# EAGLE design Dual_OTA_VCA (EAGLE 7.2.0)
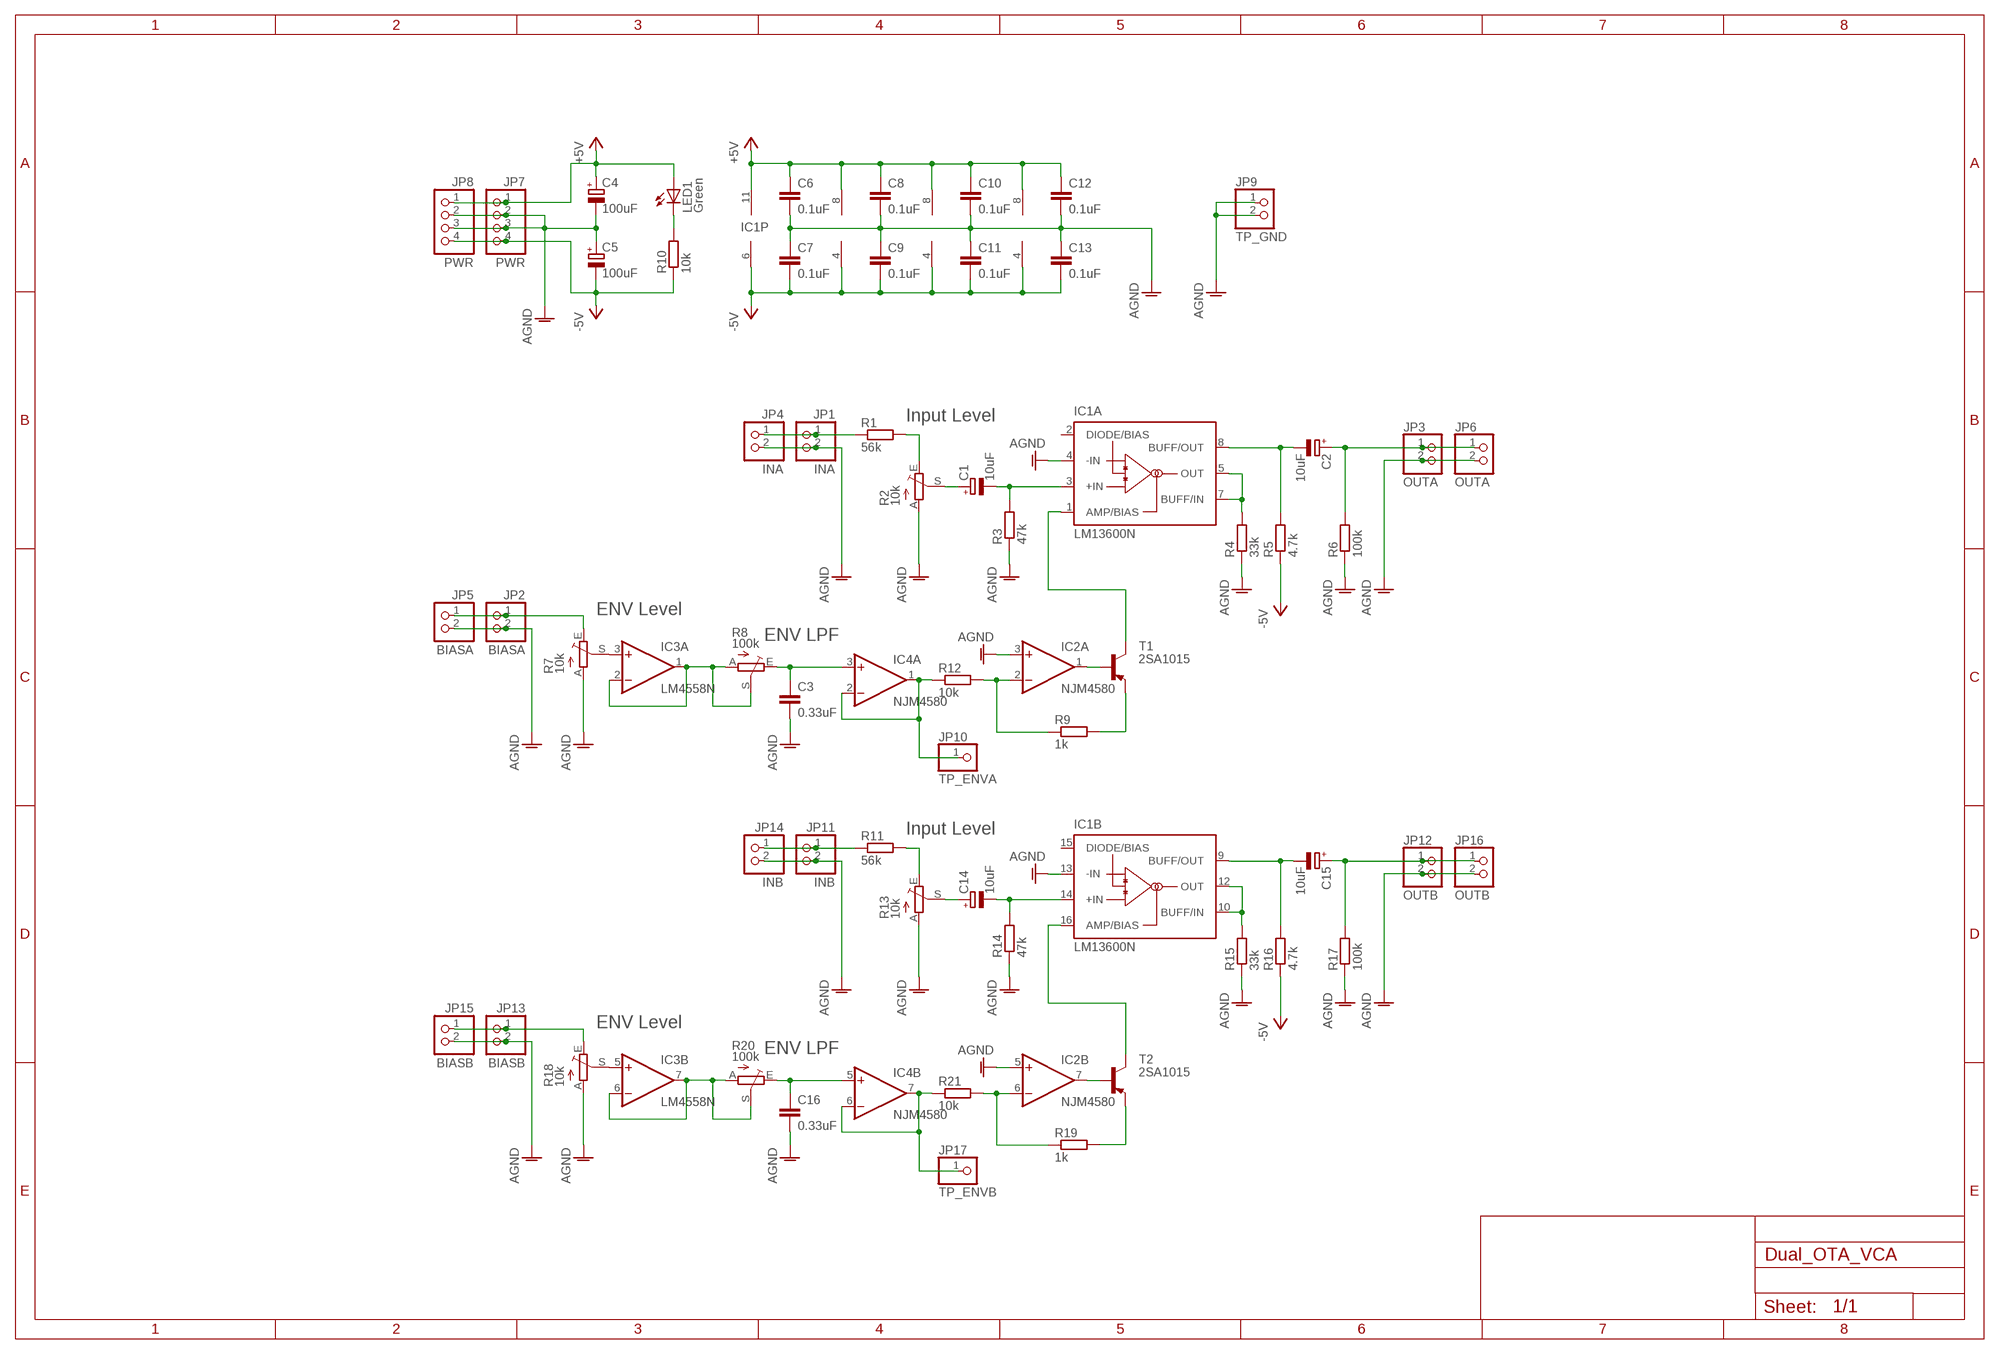
[diagram p0: schematic, sheet 1]

## Parts
C1  10uF  CPOL-EUE2.5-7  [E2,5-7]
C2  10uF  CPOL-EUE2.5-7  [E2,5-7]
C3  0.33uF  C-EU050-030X075  [C050-030X075]
C4  100uF  CPOL-EUE2.5-7  [E2,5-7]
C5  100uF  CPOL-EUE2.5-7  [E2,5-7]
C6  0.1uF  C-EU050-024X044  [C050-024X044]
C7  0.1uF  C-EU050-024X044  [C050-024X044]
C8  0.1uF  C-EU025-024X044  [C025-024X044]
C9  0.1uF  C-EU025-024X044  [C025-024X044]
C10  0.1uF  C-EU025-024X044  [C025-024X044]
C11  0.1uF  C-EU025-024X044  [C025-024X044]
C12  0.1uF  C-EU025-024X044  [C025-024X044]
C13  0.1uF  C-EU025-024X044  [C025-024X044]
C14  10uF  CPOL-EUE2.5-7  [E2,5-7]
C15  10uF  CPOL-EUE2.5-7  [E2,5-7]
C16  0.33uF  C-EU050-030X075  [C050-030X075]
IC1  LM13600N  [DIL16]
IC2  NJM4580  LM4558N  [DIL08]
IC3  LM4558N  [DIL08]
IC4  NJM4580  LM4558N  [DIL08]
JP1  INA  PINHD-1X2  [1X02]
JP2  BIASA  PINHD-1X2  [1X02]
JP3  OUTA  PINHD-1X2  [1X02]
JP4  INA  PINHD-1X2  [1X02]
JP5  BIASA  PINHD-1X2  [1X02]
JP6  OUTA  PINHD-1X2  [1X02]
JP7  PWR  PINHD-1X4  [1X04]
JP8  PWR  PINHD-1X4  [1X04]
JP9  TP_GND  PINHD-1X2  [1X02]
JP10  TP_ENVA  PINHD-1X1  [1X01]
JP11  INB  PINHD-1X2  [1X02]
JP12  OUTB  PINHD-1X2  [1X02]
JP13  BIASB  PINHD-1X2  [1X02]
JP14  INB  PINHD-1X2  [1X02]
JP15  BIASB  PINHD-1X2  [1X02]
JP16  OUTB  PINHD-1X2  [1X02]
JP17  TP_ENVB  PINHD-1X1  [1X01]
LED1  Green  LED3MM  [LED3MM]
R1  56k  R-EU_0207/7  [0207/7]
R2  10k  TRIM_EU-B25P  [B25P]
R3  47k  R-EU_0207/7  [0207/7]
R4  33k  R-EU_0207/7  [0207/7]
R5  4.7k  R-EU_0207/7  [0207/7]
R6  100k  R-EU_0207/7  [0207/7]
R7  10k  TRIM_EU-B25P  [B25P]
R8  100k  TRIM_EU-B25P  [B25P]
R9  1k  R-EU_0207/7  [0207/7]
R10  10k  R-EU_0207/7  [0207/7]
R11  56k  R-EU_0207/7  [0207/7]
R12  10k  R-EU_0207/7  [0207/7]
R13  10k  TRIM_EU-B25P  [B25P]
R14  47k  R-EU_0207/7  [0207/7]
R15  33k  R-EU_0207/7  [0207/7]
R16  4.7k  R-EU_0207/7  [0207/7]
R17  100k  R-EU_0207/7  [0207/7]
R18  10k  TRIM_EU-B25P  [B25P]
R19  1k  R-EU_0207/7  [0207/7]
R20  100k  TRIM_EU-B25P  [B25P]
R21  10k  R-EU_0207/7  [0207/7]
T1  2SA1015  -PNP-TO92-ECB  [TO92-ECB]
T2  2SA1015  -PNP-TO92-ECB  [TO92-ECB]

## Nets
+5V: C4.+ C6.1 C8.1 C10.1 C12.1 IC1.11(P:V+) IC2.8(P:V+) IC3.8(P:V+) IC4.8(P:V+) JP7.1 JP8.1 LED1.A
-5V: C5.- C7.2 C9.2 C11.2 C13.2 IC1.6(P:V-) IC2.4(P:V-) IC3.4(P:V-) IC4.4(P:V-) JP7.4 JP8.4 R5.1 R10.1 R16.1
AGND: C3.2 C4.- C5.+ C6.2 C7.1 C8.2 C9.1 C10.2 C11.1 C12.2 C13.1 C16.2 IC1.4(A:-IN) IC1.13(B:-IN) IC2.3(A:+IN) IC2.5(B:+IN) JP1.2 JP2.2 JP3.2 JP4.2 JP5.2 JP6.2 JP7.2 JP7.3 JP8.2 JP8.3 JP9.1 JP9.2 JP11.2 JP12.2 JP13.2 JP14.2 JP15.2 JP16.2 R2.A R3.1 R4.1 R6.1 R7.A R13.A R14.1 R15.1 R17.1 R18.A
N$1: JP1.1 JP4.1 R1.1
N$2: R1.2 R2.E
N$3: C1.+ R2.S
N$4: C1.- IC1.3(A:+IN) R3.2
N$5: IC1.5(A:OUT) IC1.7(A:BUFF/IN) R4.2
N$6: C2.- IC1.8(A:BUFF/OUT) R5.2
N$7: IC4.1(A:OUT) IC4.2(A:-IN) JP10.1 R12.1
N$8: C2.+ JP3.1 JP6.1 R6.2
N$9: IC2.2(A:-IN) R9.1 R12.2
N$10: JP2.1 JP5.1 R7.E
N$11: R9.2 T1.E
N$12: IC2.1(A:OUT) T1.B
N$13: IC3.5(B:+IN) R18.S
N$14: IC1.1(A:AMP/BIAS) T1.C
N$15: LED1.K(C) R10.2
N$16: JP11.1 JP14.1 R11.1
N$17: IC3.3(A:+IN) R7.S
N$18: IC3.1(A:OUT) IC3.2(A:-IN) R8.A R8.S
N$19: C3.1 IC4.3(A:+IN) R8.E
N$20: R11.2 R13.E
N$21: C14.+ R13.S
N$22: C14.- IC1.14(B:+IN) R14.2
N$23: IC1.10(B:BUFF/IN) IC1.12(B:OUT) R15.2
N$24: C15.- IC1.9(B:BUFF/OUT) R16.2
N$25: C15.+ JP12.1 JP16.1 R17.2
N$26: JP13.1 JP15.1 R18.E
N$27: IC2.6(B:-IN) R19.1 R21.2
N$28: R19.2 T2.E
N$29: IC2.7(B:OUT) T2.B
N$30: IC1.16(B:AMP/BIAS) T2.C
N$32: IC3.6(B:-IN) IC3.7(B:OUT) R20.A R20.S
N$33: C16.1 IC4.5(B:+IN) R20.E
N$34: IC4.6(B:-IN) IC4.7(B:OUT) JP17.1 R21.1
Unconnected: IC1.2(A:DIODE/BIAS) IC1.15(B:DIODE/BIAS)

## Notes on the sheet
- Input Level
- ENV Level
- ENV LPF
- Input Level
- ENV Level
- ENV LPF

## Library data of the parts
C1 C2 C4 C5 C14 C15 = rcl:CPOL-EU: POLARIZED CAPACITOR, European symbol
C3 C6-C13 C16 = rcl:C-EU: CAPACITOR, European symbol
IC1 = national-semiconductor:LM13600: Dual Operational Transconductance Amplifiers with Linearizing Diodes and Buffers Source: lm13600.PDF
IC2-IC4 = linear:*4558: OP AMP
JP1-JP6 JP9 JP11-JP16 = pinhead:PINHD-1X2: PIN HEADER
JP7 JP8 = pinhead:PINHD-1X4: PIN HEADER
JP10 JP17 = pinhead:PINHD-1X1: PIN HEADER
LED1 = led:LED: LED OSRAM: - CHIPLED LG R971, LG N971, LY N971, LG Q971, LY Q971, LO R971, LY R971 LH N974, LH R974 LS Q976, LO Q976, LY Q976 LO Q996 - Hyper CHIPLED LW Q18S LB Q993, LB Q99A, LB R99A - SideLED LS A670, LO A670, LY A670, LG A670, LP A670 LB A673, LV A673, LT A673, LW A673 LH A674 LY A675 LS A676, LA A676, LO A676, LY A676, LW A676 LS A679, LY A679, LG A679 - Hyper Micro SIDELED® LS Y876, LA Y876, LO Y876, LY Y876 LT Y87S - SmartLED LW L88C, LW L88S LB L89C, LB L89S, LG L890 LS L89K, LO L89K, LY L89K LS L896, LA L896, LO L896, LY L896 - TOPLED LS T670, LO T670, LY T670, LG T670, LP T670 LSG T670, LSP T670, LSY T670, LOP T670, LYG T670 LG T671, LOG T671, LSG T671 LB T673, LV T673, LT T673, LW T673 LH T674 LS T676, LA T676, LO T676, LY T676, LB T676, LH T676, LSB T676, LW T676 LB T67C, LV T67C, LT T67C, LS T67K, LO T67K, LY T67K, LW E67C LS E67B, LA E67B, LO E67B, LY E67B, LB E67C, LV E67C, LT E67C LW T67C LS T679, LY T679, LG T679 LS T770, LO T770, LY T770, LG T770, LP T770 LB T773, LV T773, LT T773, LW T773 LH T774 LS E675, LA E675, LY E675, LS T675 LS T776, LA T776, LO T776, LY T776, LB T776 LHGB T686 LT T68C, LB T68C - Hyper Mini TOPLED® LB M676 - Mini TOPLED Santana® LG M470 LS M47K, LO M47K, LY M47K Source: http://www.osram.convergy.de LUXEON: - LUMILED® LXK2-PW12-R00, LXK2-PW12-S00, LXK2-PW14-U00, LXK2-PW14-V00 LXK2-PM12-R00, LXK2-PM12-S00, LXK2-PM14-U00 LXK2-PE12-Q00, LXK2-PE12-R00, LXK2-PE12-S00, LXK2-PE14-T00, LXK2-PE14-U00 LXK2-PB12-K00, LXK2-PB12-L00, LXK2-PB12-M00, LXK2-PB14-N00, LXK2-PB14-P00, LXK2-PB14-Q00 LXK2-PR12-L00, LXK2-PR12-M00, LXK2-PR14-Q00, LXK2-PR14-R00 LXK2-PD12-Q00, LXK2-PD12-R00, LXK2-PD12-S00 LXK2-PH12-R00, LXK2-PH12-S00 LXK2-PL12-P00, LXK2-PL12-Q00, LXK2-PL12-R00 Source: www.luxeon.com KINGBRIGHT: KA-3528ASYC Source: www.kingbright.com
R1 R3-R6 R9-R12 R14-R17 R19 R21 = rcl:R-EU_: RESISTOR, European symbol
R2 R7 R8 R13 R18 R20 = pot:TRIM_EU-: POTENTIOMETER
T1 T2 = transistor-neu-to92:*-PNP-: PNP Transistror

## Board
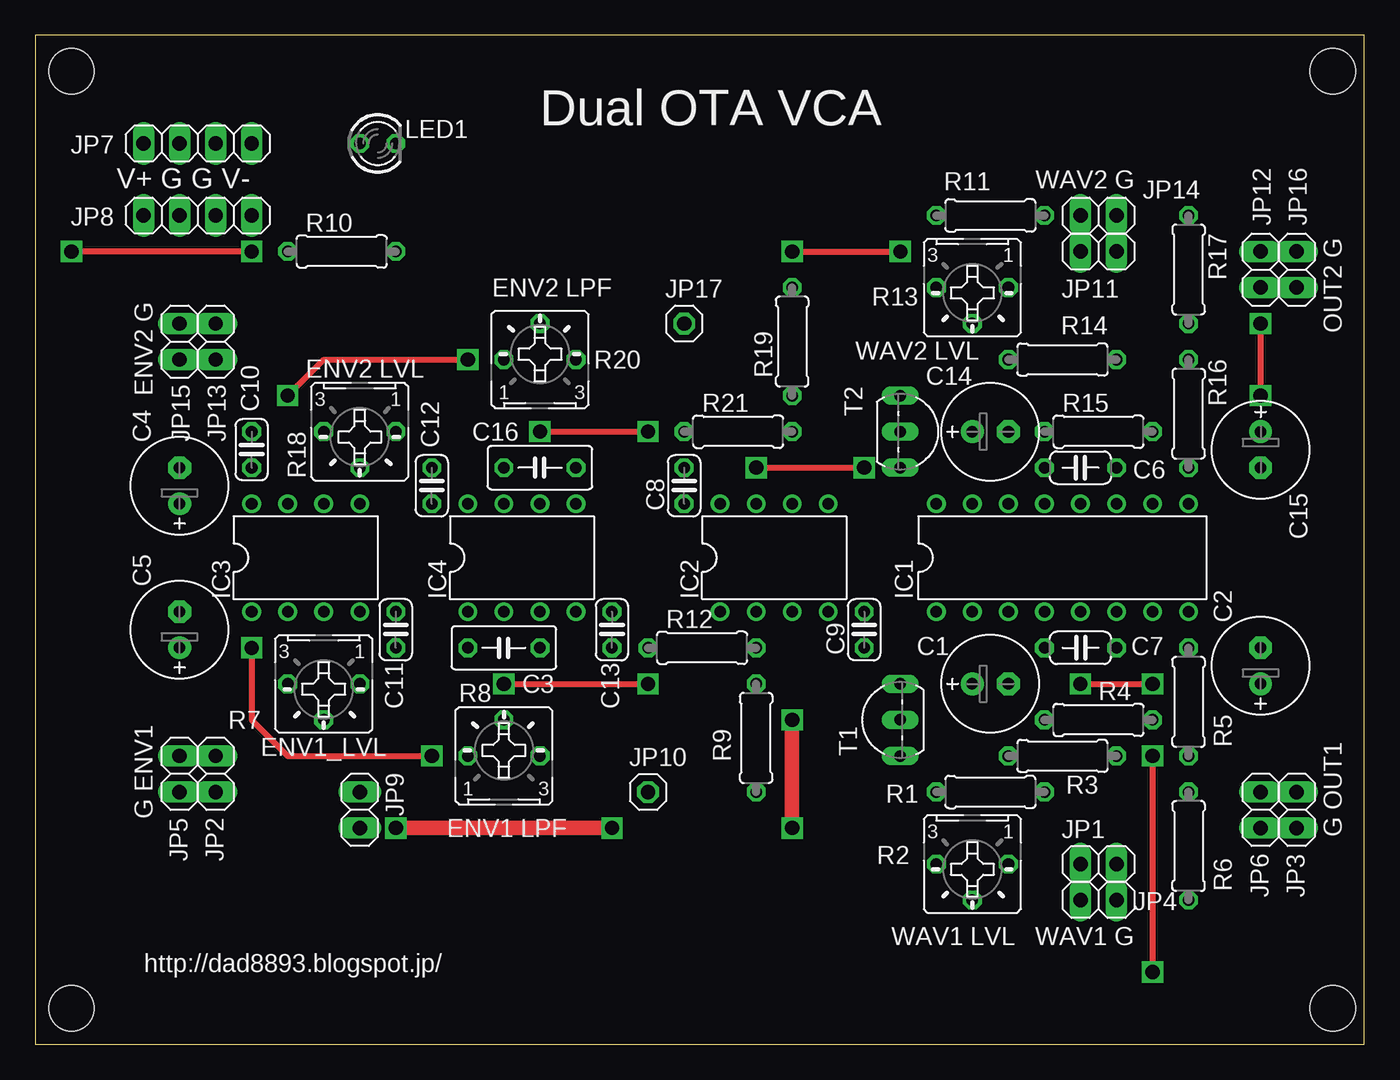
[diagram p1: board, top side]
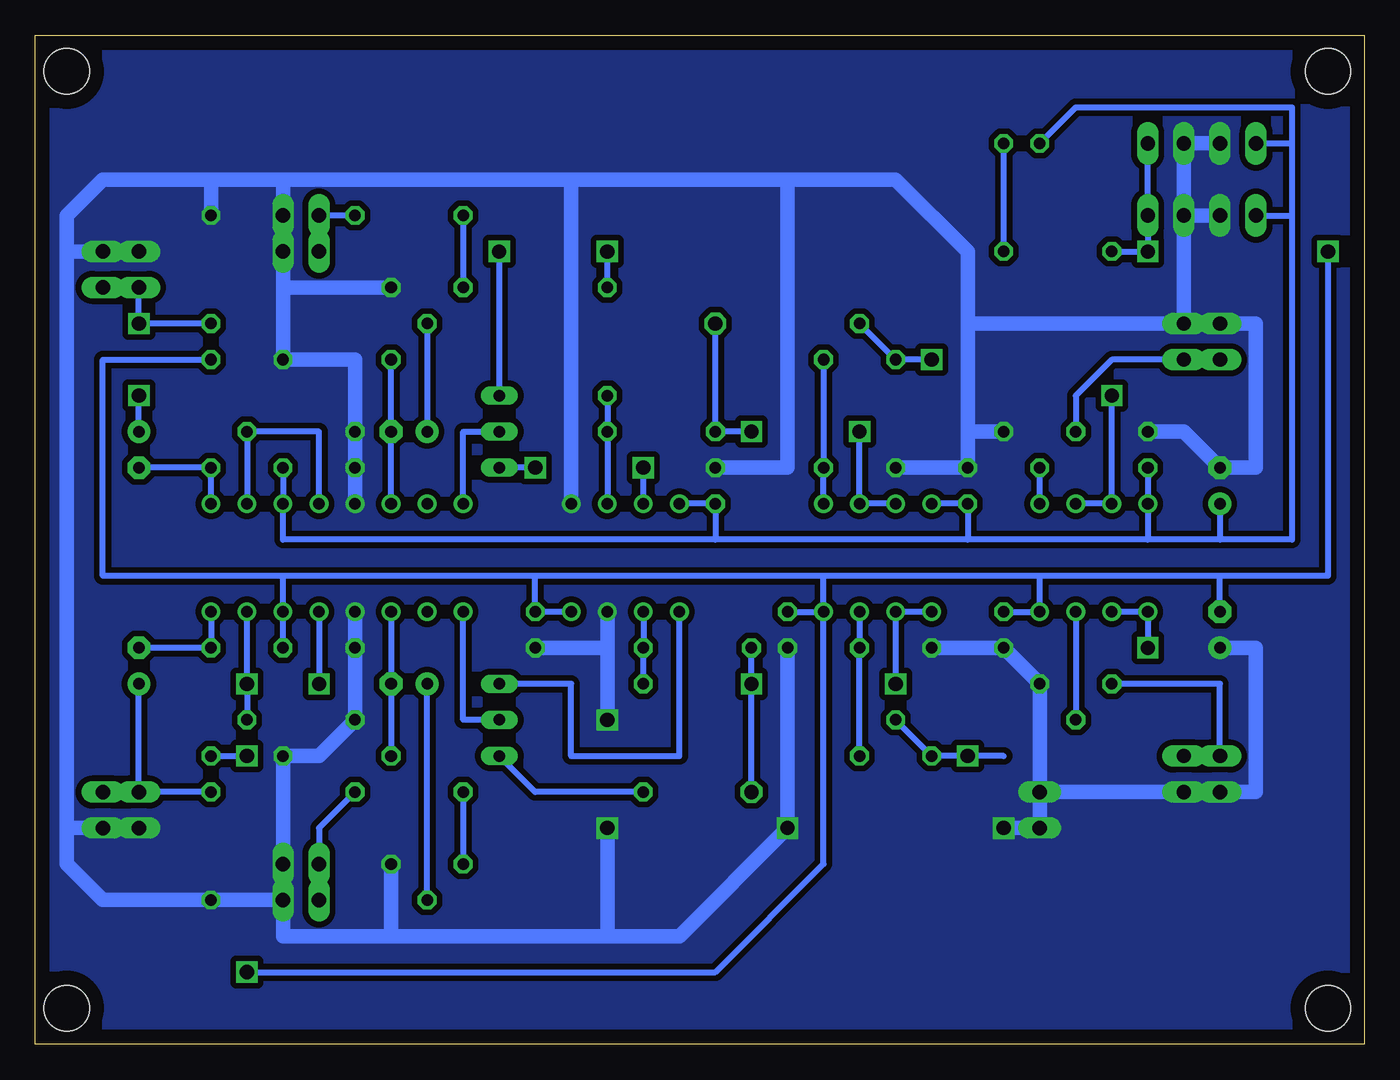
[diagram p2: board, bottom side, seen from below]

Size 93.65 x 71.11 mm. Coordinates in mm from the lower left corner, seen from the top.
Outline: 0,0 93.65,0 93.65,71.11 0,71.11 0,0
Copper layers (1*16): Top 0.035mm / dielectric 1.5mm / Bottom 0.035mm
Design rules "default": minimum track width 10mil, minimum drill 24mil, track to track 8mil, track to pad 8mil, pad to pad 8mil, via to via 8mil, smd to smd 8mil, copper to edge 40mil, drill to drill 8mil, minimum pad ring 10mil, minimum via ring 8mil, stop-mask expansion 4mil, vias tented up to drill 0mil, thermal gap 10mil
Holes 3.2 mm at 2.54,68.58 2.54,2.54 91.44,2.54 91.44,68.58

### Footprints (pad centres in the part's own frame; a part is rotated, then mirrored left to right if it is on the bottom)
E2,5-7 = drill 0.813 pad 1.6: + -1.27,0 | drill 0.813 pad 1.6 octagon: - 1.27,0
C050-030X075 = drill 0.813 octagon: 1 -2.54,0; 2 2.54,0
C050-024X044 = drill 0.813 octagon: 1 -2.54,0; 2 2.54,0
C025-024X044 = drill 0.813 octagon: 1 -1.27,0; 2 1.27,0
DIL16 = drill 0.813 pad 1.27: 1 -8.89,-3.81; 2 -6.35,-3.81; 3 -3.81,-3.81; 4 -1.27,-3.81; 5 1.27,-3.81; 6 3.81,-3.81; 7 6.35,-3.81; 8 8.89,-3.81; 9 8.89,3.81; 10 6.35,3.81; 11 3.81,3.81; 12 1.27,3.81; 13 -1.27,3.81; 14 -3.81,3.81; 15 -6.35,3.81; 16 -8.89,3.81
DIL08 = drill 0.813 pad 1.27: 1 -3.81,-3.81; 2 -1.27,-3.81; 3 1.27,-3.81; 4 3.81,-3.81; 5 3.81,3.81; 6 1.27,3.81; 7 -1.27,3.81; 8 -3.81,3.81
1X02 = drill 1.016 long: 1 -1.27,0; 2 1.27,0
1X04 = drill 1.016 long: 1 -3.81,0; 2 -1.27,0; 3 1.27,0; 4 3.81,0
1X01 = drill 1.016 octagon: 1 0,0
LED3MM = drill 0.813 octagon: A -1.27,0; K 1.27,0
0207/7 = drill 0.813 octagon: 1 -3.81,0; 2 3.81,0
B25P = drill 0.813 octagon: A -2.54,0; E 2.54,0; S 0,2.54
TO92-ECB = drill 0.813 long: B 2.54,0; C 0,0; E -2.54,0

### Placement (x,y rotation side)
C1  67.31,25.4 0 top
C2  86.36,26.67 90 top
C3  33.02,27.94 180 top
C4  10.16,39.37 90 top
C5  10.16,29.21 90 top
C6  73.66,40.64 180 top
C7  73.66,27.94 0 top
C8  45.72,39.37 90 top
C9  58.42,29.21 90 top
C10  15.24,41.91 90 top
C11  25.4,29.21 90 top
C12  27.94,39.37 90 top
C13  40.64,29.21 90 top
C14  67.31,43.18 0 top
C15  86.36,41.91 270 top
C16  35.56,40.64 180 top
IC1  72.39,34.29 0 top
IC2  52.07,34.29 0 top
IC3  19.05,34.29 0 top
IC4  34.29,34.29 0 top
JP1  74.93,12.7 0 top
JP2  12.7,19.05 270 top
JP3  88.9,16.51 270 top
JP4  74.93,10.16 0 top
JP5  10.16,19.05 270 top
JP6  86.36,16.51 270 top
JP7  11.43,63.5 0 top
JP8  11.43,58.42 0 top
JP9  22.86,16.51 270 top
JP10  43.18,17.78 0 top
JP11  74.93,55.88 0 top
JP12  86.36,54.61 90 top
JP13  12.7,49.53 90 top
JP14  74.93,58.42 0 top
JP15  10.16,49.53 90 top
JP16  88.9,54.61 90 top
JP17  45.72,50.8 0 top
LED1  24.13,63.5 0 top
R1  67.31,17.78 180 top
R2  66.04,12.7 180 top
R3  72.39,20.32 180 top
R4  74.93,22.86 0 top
R5  81.28,24.13 90 top
R6  81.28,13.97 90 top
R7  20.32,25.4 180 top
R8  33.02,20.32 0 top
R9  50.8,21.59 270 top
R10  21.59,55.88 0 top
R11  67.31,58.42 180 top
R12  46.99,27.94 0 top
R13  66.04,53.34 180 top
R14  72.39,48.26 180 top
R15  74.93,43.18 0 top
R16  81.28,44.45 270 top
R17  81.28,54.61 270 top
R18  22.86,43.18 180 top
R19  53.34,49.53 90 top
R20  35.56,48.26 0 top
R21  49.53,43.18 0 top
T1  60.96,22.86 90 top
T2  60.96,43.18 270 top

### Tracks (layer width: path | path; a pad name or v marks a point on that pad's centre or on a via)
+5V
  Bottom 0.406: C10.1 IC3.8 15.24,35.56 | JP8.1 5.08,58.42 | 5.08,58.42 5.08,35.56 10.16,35.56 | 10.16,35.56 15.24,35.56 | 15.24,35.56 27.94,35.56 | 27.94,35.56 45.72,35.56 | 45.72,35.56 76.2,35.56 IC1.11 C6.1 | IC4.8 C12.1 27.94,35.56 | IC2.8 C8.1 45.72,35.56 | C4.+ 10.16,35.56 | 5.08,63.5 5.08,58.42 | JP7.1 5.08,63.5 | LED1.A 20.32,66.04 5.08,66.04 5.08,63.5
-5V  (via drill 1)
  Top 0.406: v78.74,20.32 v78.74,5.08 | v15.24,55.88 v2.54,55.88
  Bottom 0.406: 76.2,33.02 IC1.6 C7.2 | 76.2,33.02 88.9,33.02 88.9,48.26 R16.1 | 22.86,33.02 38.1,33.02 | 38.1,33.02 58.42,33.02 | 58.42,33.02 76.2,33.02 | R5.1 v78.74,20.32 | IC2.4 C9.2 58.42,33.02 | IC4.4 38.1,33.02 | C13.2 IC4.4 | C11.2 IC3.4 22.86,33.02 | v78.74,5.08 45.72,5.08 38.1,12.7 IC4.4 | C5.- 10.16,33.02 | 10.16,33.02 22.86,33.02 | JP7.4 JP8.4 v15.24,55.88 R10.1 | v2.54,55.88 2.54,33.02 10.16,33.02
AGND  (via drill 1)
  Top 1.016: v53.34,22.86 v53.34,15.24 | v40.64,15.24 v25.4,15.24
  Bottom 1.016: IC1.4 C7.1 R4.1 73.66,20.32 R3.1 JP1.2 JP4.2 | JP4.2 R6.1 88.9,10.16 91.44,12.7 91.44,15.24 | 91.44,15.24 91.44,55.88 | 91.44,55.88 JP16.2 JP12.2 | IC2.3 53.34,27.94 | 53.34,27.94 C9.1 | JP4.2 76.2,7.62 68.58,7.62 | JP6.2 JP3.2 91.44,15.24 | 53.34,27.94 v53.34,22.86 | JP9.1 JP9.2 v25.4,15.24 | JP9.1 R7.A C11.1 C3.2 | 68.58,7.62 53.34,7.62 | 53.34,7.62 48.26,7.62 v40.64,15.24 C13.1 | JP9.1 JP2.2 JP5.2 7.62,17.78 7.62,27.94 C5.+ | IC1.13 C6.2 R15.1 71.12,48.26 R14.1 76.2,53.34 | R13.A 76.2,53.34 | 76.2,53.34 JP11.2 JP14.2 76.2,60.96 | IC2.5 55.88,60.96 | 55.88,60.96 76.2,60.96 | 76.2,60.96 81.28,60.96 | R17.1 81.28,60.96 | C8.2 40.64,40.64 40.64,60.96 | 40.64,60.96 55.88,60.96 | 27.94,43.18 C12.2 C16.2 | 27.94,43.18 27.94,50.8 | R18.A 27.94,43.18 | JP13.2 27.94,50.8 | JP13.2 JP15.2 7.62,50.8 7.62,40.64 C4.- 12.7,43.18 C10.2 | JP8.2 JP8.3 | JP8.3 JP13.2 | JP8.3 JP7.3 JP7.2 | R2.A 68.58,7.62 | v53.34,15.24 53.34,7.62 | 27.94,50.8 27.94,55.88 33.02,60.96 40.64,60.96 | 81.28,60.96 88.9,60.96 91.44,58.42 91.44,55.88
  pour Bottom (isolate 0.406, no thermals): 0,71.12 0,0 93.98,0 93.98,71.12 91.44,71.12
N$1
  Bottom 0.406: R1.1 73.66,15.24 JP1.1 JP4.1
N$2
  Bottom 0.406: R1.2 R2.E
N$3
  Bottom 0.406: R2.S C1.+
N$4
  Bottom 0.406: IC1.3 C1.- R3.2
N$5  (via drill 1)
  Top 0.406: v73.66,25.4 v78.74,25.4
  Bottom 0.406: IC1.5 v73.66,25.4 | IC1.7 v78.74,25.4 R4.2
N$6
  Bottom 0.406: IC1.8 R5.2 C2.-
N$7  (via drill 1)
  Top 0.406: v33.02,25.4 v43.18,25.4
  Bottom 0.406: IC4.1 IC4.2 v33.02,25.4 | R12.1 v43.18,25.4 JP10.1
N$8
  Bottom 0.406: R6.2 JP6.1 | JP3.1 JP6.1 | JP6.1 C2.+
N$9
  Bottom 0.406: IC2.2 R12.2 R9.1
N$10
  Bottom 0.406: R7.E 10.16,25.4 JP5.1 JP2.1
N$11
  Bottom 0.406: R9.2 58.42,17.78 T1.E
N$12
  Bottom 0.406: IC2.1 48.26,20.32 55.88,20.32 55.88,25.4 T1.B
N$13
  Bottom 0.406: IC3.5 R18.S
N$14
  Bottom 0.406: T1.C 63.5,22.86 IC1.1
N$15
  Bottom 0.406: R10.2 LED1.K
N$16
  Bottom 0.406: R11.1 JP14.1 JP11.1
N$17
  Bottom 0.406: IC3.3 R7.S
N$18  (via drill 1)
  Top 0.406: v15.24,27.94 15.24,22.86 17.78,20.32 v27.94,20.32
  Bottom 0.406: R8.S R8.A v27.94,20.32 25.4,20.32 | IC3.2 IC3.1 v15.24,27.94
N$19
  Bottom 0.406: IC4.3 C3.1 R8.E
N$20
  Bottom 0.406: R11.2 R13.E
N$21
  Bottom 0.406: R13.S C14.+
N$22
  Bottom 0.406: IC1.14 C14.- R14.2
N$23
  Bottom 0.406: IC1.12 73.66,43.18 R15.2 IC1.10
N$24
  Bottom 0.406: IC1.9 R16.2 C15.-
N$25  (via drill 1)
  Top 0.406: v86.36,45.72 v86.36,50.8
  Bottom 0.406: C15.+ v86.36,45.72 | R17.2 v86.36,50.8 JP12.1 JP16.1
N$26
  Bottom 0.406: R18.E 20.32,45.72 17.78,48.26 JP13.1 JP15.1
N$27
  Bottom 0.406: R19.1 R21.2 IC2.6
N$28  (via drill 1)
  Top 0.406: v53.34,55.88 v60.96,55.88
  Bottom 0.406: v60.96,55.88 T2.E | R19.2 v53.34,55.88
N$29  (via drill 1)
  Top 0.406: v50.8,40.64 v58.42,40.64
  Bottom 0.406: IC2.7 v50.8,40.64 | v58.42,40.64 T2.B
N$30
  Bottom 0.406: IC1.16 63.5,43.18 T2.C
N$32  (via drill 1)
  Top 0.406: v17.78,45.72 20.32,48.26 v30.48,48.26
  Bottom 0.406: IC3.6 IC3.7 v17.78,45.72 | R20.S R20.A v30.48,48.26
N$33
  Bottom 0.406: R20.E C16.1 IC4.5
N$34  (via drill 1)
  Top 0.406: v35.56,43.18 v43.18,43.18
  Bottom 0.406: IC4.7 IC4.6 v35.56,43.18 | v43.18,43.18 R21.1 JP17.1

### Text on the board
tNames: Dual OTA VCA | V+ G G V- | WAV2 G | ENV2 LPF | OUT2 G | WAV2 LVL | ENV2 LVL | ENV2 G | ENV1_LVL | G ENV1 | ENV1 LPF | G OUT1 | WAV1 G | WAV1 LVL | http://dad8893.blogspot.jp/